# Altium schematic sheet 05_LOWPASS_IQ.SchDoc
size A3; SheetNumber: 5; SheetTotal: 6
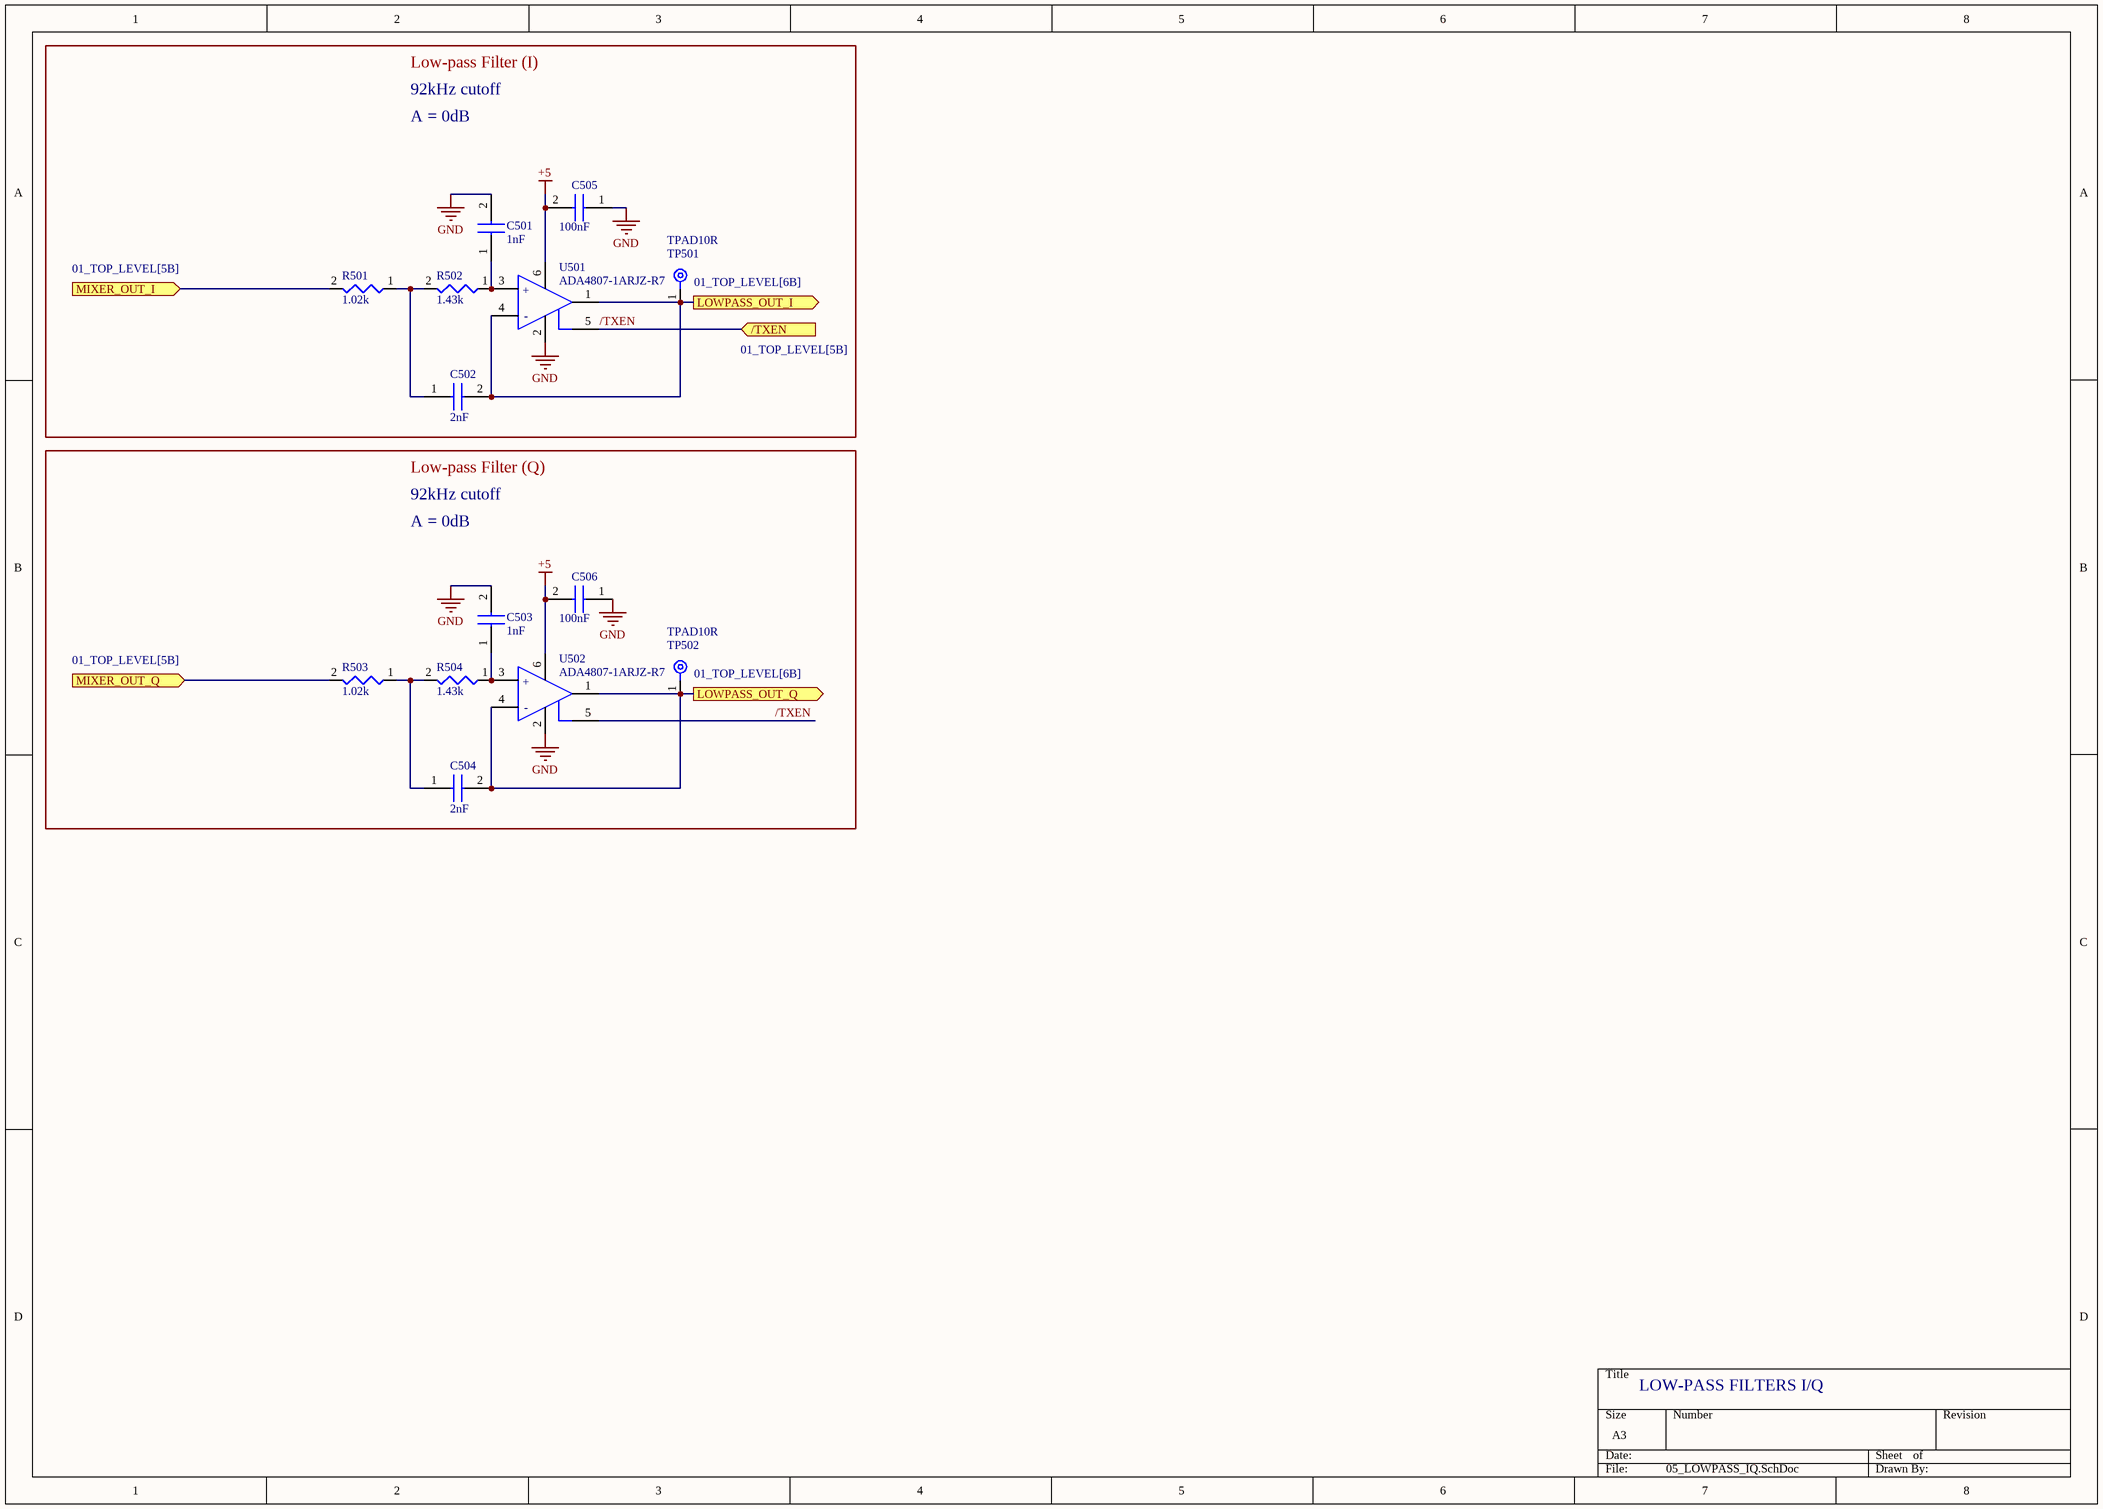
[diagram p0: 05_LOWPASS_IQ.SchDoc]

## Parts
C501  1nF  [CAP_0805]
C502  2nF  [CAP_0805]
C503  1nF  [CAP_0805]
C504  2nF  [CAP_0805]
C505  100nF  [CAP_0805]
C506  100nF  [CAP_0805]
R501  1.02k  [RES_0805]
R502  1.43k  [RES_0805]
R503  1.02k  [RES_0805]
R504  1.43k  [RES_0805]
TP501  TPAD10R  [TEST_POINT]
TP502  TPAD10R  [TEST_POINT]
U501  ADA4807-1ARJZ-R7  [FP-RJ-6-IPC_A]
U502  ADA4807-1ARJZ-R7  [FP-RJ-6-IPC_A]

## Ports
/TXEN (in, see 01_TOP_LEVEL[5B]), LOWPASS_OUT_I (out, see 01_TOP_LEVEL[6B]), LOWPASS_OUT_Q (out, see 01_TOP_LEVEL[6B]), MIXER_OUT_I (in, see 01_TOP_LEVEL[5B]), MIXER_OUT_Q (in, see 01_TOP_LEVEL[5B])

## Nets
+5: C505.2 C506.2 U501.6(+VS) U502.6(+VS)
GND: C501.2 C503.2 C505.1 C506.1 U501.2(-VS) U502.2(-VS)
/TXEN: U501.5(~{DISABLE}) U502.5(~{DISABLE}) ; port /TXEN
LOWPASS_OUT_I: C502.2 TP501.1 U501.1(VOUT) U501.4(-IN) ; port LOWPASS_OUT_I
LOWPASS_OUT_Q: C504.2 TP502.1 U502.1(VOUT) U502.4(-IN) ; port LOWPASS_OUT_Q
MIXER_OUT_I: R501.2 ; port MIXER_OUT_I
MIXER_OUT_Q: R503.2 ; port MIXER_OUT_Q
NetC501_1: C501.1 R502.1 U501.3(+IN)
NetC502_1: C502.1 R501.1 R502.2
NetC503_1: C503.1 R504.1 U502.3(+IN)
NetC504_1: C504.1 R503.1 R504.2

## Notes on the sheet
- Low-pass Filter (I)
- 92kHz cutoff
- A = 0dB
- Low-pass Filter (Q)
- LOW-PASS FILTERS I/Q
- (in symbol CMP-09116-000179-1) +; -

## Library data of the parts
C501-C506 = CAP_0805: Capacitor SMD 0805; Height: 0.94mm
R501-R504 = RES_0805: Resistor SMD 0805
TP501 TP502 = TEST_POINT: Testpont Pad 10R
U501 U502 = CMP-09116-000179-1: IC OPAMP VFB 1 CIRCUIT SOT23-6; -3db Bandwidth: 180MHz; Max Frequency: 100kHz; Bandwidth: 200MHz; Min Supply Voltage: 3V; Max Input Voltage: 11V; Common Mode Rejection Ratio: 96dB; Power Supply Rejection Ratio (PSRR): 105dB; Output Current: 60mA; Input Offset Voltage (Vos): 20uV; Output Current per Channel: 106mA; Number of Circuits: 1; Min Input Voltage: 2.7V; Operating Supply Voltage: 10V; Input Bias Current: 1.2uA; Operating Supply Current: 950uA; Voltage Gain: 130dB; Slew Rate: 225V/µs; Dual Supply Voltage: 5V; Height: 1.3mm; Min Operating Temperature: -40°C; Mount: Surface Mount; Lead Free: Contains Lead; Gain Bandwidth Product: 200MHz; Contact Plating: Tin; Width: 1.7mm; Packaging: Cut Tape; Max Operating Temperature: 125°C; Case/Package: SOT-23-6; Number of Pins: 6; Length: 3mm; REACH SVHC: No SVHC; Max Supply Voltage: 11V; RoHS Compliant: Yes; Number of Amplifiers: 1; ComponentLink1Description: DigiKey; ComponentLink1URL: https://www.digikey.com/en/products/detail/analog-devices-inc/ADA4807-1ARJZ-R2/5057389